# Altium project AerO2.PrjPcb
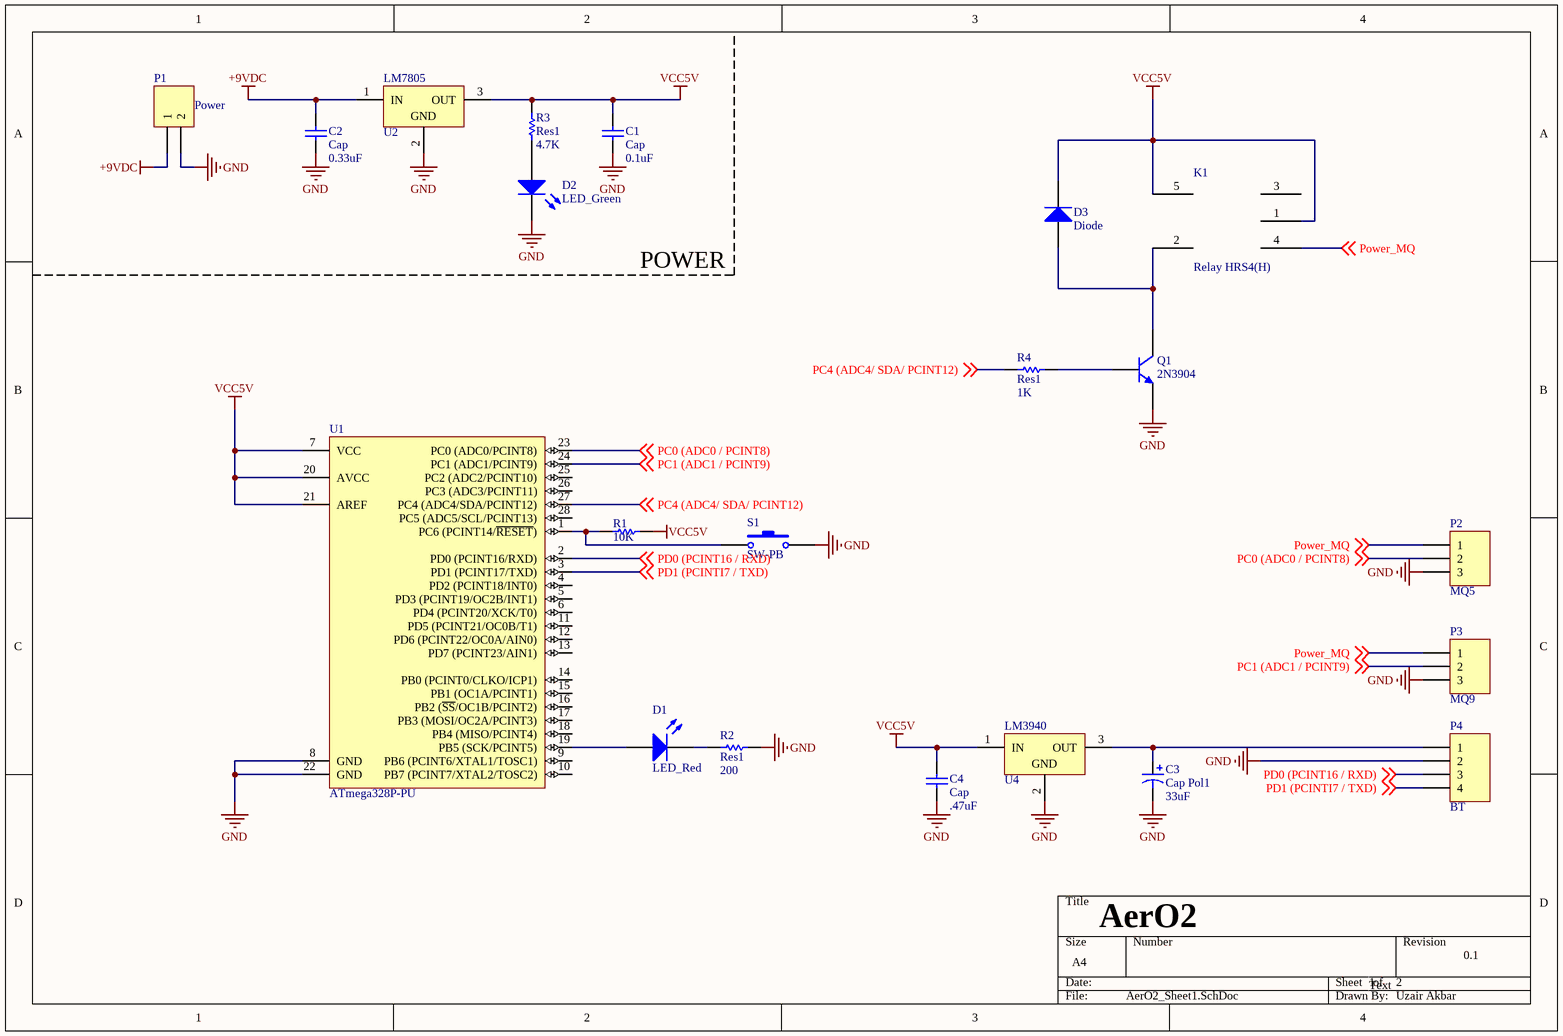
[diagram p0: AerO2_Sheet1.SchDoc]
1 sheet, 21 parts. Net scope: global (net labels, ports and power ports of the same name join across sheets).
Board file: AerO2_PCB1.PcbDoc

## Sheet AerO2_Sheet1.SchDoc: AerO2
size A4; Author: Uzair Akbar; DrawnBy: Uzair Akbar; DocumentNumber: 1; Revision: 0.1; SheetNumber: 1; SheetTotal: 2

### Parts
C1  Cap  value 0.1uF  [RAD-0.1]
C2  Cap  value 0.33uF  [RAD-0.1]
C3  Cap Pol1  value 33uF  [RB5-10.5]
C4  Cap  value .47uF  [RAD-0.1]
D1  LED_Red  [LED-0]
D2  LED_Green  [LED-0]
D3  Diode  [DIODE-0.4]
K1  Relay HRS4(H)  [Relay HRS4(H)]
P1  Power  [HDR1X2]
P2  MQ5  [HDR1X3]
P3  MQ9  [HDR1X3]
P4  BT  [HDR1X4]
Q1  2N3904  [TO-92A]
R1  value 10K  [AXIAL-0.3]  (hidden comment: Res1)
R2  Res1  value 200  [AXIAL-0.3]
R3  Res1  value 4.7K  [AXIAL-0.3]
R4  Res1  value 1K  [AXIAL-0.3]
S1  SW-PB  [SPST-2]
U1  ATmega328P-PU  [28P3]
U2  LM7805  [TO-262-AA]
U4  LM3940  [TO-262-AA]

### Nets
+9VDC: C2.1 P1.1 U2.1(IN)
GND: C1.2 C2.2 C3.2 C4.1 D2.2(K) P1.2 P2.3 P3.3 P4.2 Q1.1(E) R2.2 S1.2 U1.8(GND) U1.22(GND) U2.2(GND) U4.2(GND)
VCC5V: C1.1 C4.2 D3.2(K) K1.1 K1.5 R1.2 R3.2 U1.7(VCC) U1.20(AVCC) U1.21(AREF) U2.3(OUT) U4.1(IN)
PC0 (ADC0 / PCINT8): P2.2 U1.23(PC0_(ADC0/PCINT8)) ; off-sheet PC0 (ADC0 / PCINT8)
PC1 (ADC1 / PCINT9): P3.2 U1.24(PC1_(ADC1/PCINT9)) ; off-sheet PC1 (ADC1 / PCINT9)
PC4 (ADC4/ SDA/ PCINT12): R4.1 U1.27(PC4_(ADC4/SDA/PCINT12)) ; off-sheet PC4 (ADC4/ SDA/ PCINT12)
PD0 (PCINT16 / RXD): P4.3 U1.2(PD0_(PCINT16/RXD)) ; off-sheet PD0 (PCINT16 / RXD)
PD1 (PCINTI7 / TXD): P4.4 U1.3(PD1_(PCINT17/TXD)) ; off-sheet PD1 (PCINTI7 / TXD)
Power_MQ: K1.4 P2.1 P3.1 ; off-sheet Power_MQ
NetC3_1: C3.1 P4.1 U4.3(OUT)
NetD1_1: D1.1(A) U1.19(PB5_(SCK/PCINT5))
NetD1_2: D1.2(K) R2.1
NetD2_1: D2.1(A) R3.1
NetD3_1: D3.1(A) K1.2 Q1.3(C)
NetQ1_2: Q1.2(B) R4.2
NetR1_1: R1.1 S1.1 U1.1(PC6_(PCINT14/~{RESET}))

Not connected (* = marked no-connect by the designer): K1 3; U1 4(PD2_(PCINT18/INT0)) 5(PD3_(PCINT19/OC2B/INT1)) 6(PD4_(PCINT20/XCK/T0)) 9(PB6_(PCINT6/XTAL1/TOSC1)) 10(PB7_(PCINT7/XTAL2/TOSC2)) 11(PD5_(PCINT21/OC0B/T1)) 12(PD6_(PCINT22/OC0A/AIN0)) 13(PD7_(PCINT23/AIN1)) 14(PB0_(PCINT0/CLKO/ICP1)) 15(PB1_(OC1A/PCINT1)) 16(PB2_(~{SS}/OC1B/PCINT2)) 17(PB3_(MOSI/OC2A/PCINT3)) 18(PB4_(MISO/PCINT4)) 25(PC2_(ADC2/PCINT10)) 26(PC3_(ADC3/PCINT11)) 28(PC5_(ADC5/SCL/PCINT13))

### Notes on the sheet
- POWER
- Text

### Library data of the parts
C1 C2 C4 = Cap: Capacitor; Published: 8-Jun-2000; LatestRevisionDate: 17-Jul-2002; LatestRevisionNote: Re-released for DXP Platform.; PackageReference: RAD-0.3; Publisher: Altium Limited; PackageDescription: Radial Cap, Thru-Hole; 2 Leads; 0.3 in Pin Spacing
C3 = Cap Pol1: Polarized Capacitor (Radial); Published: 8-Jun-2000; LatestRevisionDate: 17-Jul-2002; LatestRevisionNote: Re-released for DXP Platform.; PackageReference: RB7.6-15; Publisher: Altium Limited; PackageDescription: Polarized Capacitor (Radial); 2 Leads
D1 D2 = LED0: Typical INFRARED GaAs LED; Published: 8-Jun-2000; LatestRevisionDate: 08-Jul-2005; LatestRevisionNote: Mech Layer 1 removed.; PackageReference: LED-0; Publisher: Altium Limited; PackageDescription: LED; 2 Leads
D3 = Diode: Default Diode; Published: 8-Jun-2000; LatestRevisionDate: 17-Jul-2002; LatestRevisionNote: Re-released for DXP Platform.; PackageVersion: Sep-1996; PackageReference: SMC; Publisher: Altium Limited; PackageDescription: DO-214-AB/SMC; 2 C-Bend Leads; Body 7.9 x 5.9 mm, inc. leads (LxW); Code_JEDEC: DO-214-AB
P1 = Header 2: Header, 2-Pin; LatestRevisionDate: 17-Jul-2002; LatestRevisionNote: Re-released for DXP Platform.; Publisher: Altium Limited
P2 P3 = Header 3: Header, 3-Pin; LatestRevisionDate: 17-Jul-2002; LatestRevisionNote: Re-released for DXP Platform.; Publisher: Altium Limited
P4 = Header 4: Header, 4-Pin; LatestRevisionDate: 17-Jul-2002; LatestRevisionNote: Re-released for DXP Platform.; Publisher: Altium Limited
Q1 = 2N3904: NPN General Purpose Amplifier; Published: 8-Jun-2000; LatestRevisionDate: 15-Jan-2003; LatestRevisionNote: PCB Footprint 'BCY-W3/D4.7' replaced; DatasheetVersion: 1997; PackageVersion: Sep-1998; PackageReference: TO-92A; Publisher: Altium Limited; PackageDescription: TO, Flat Index; 3 In-Line, Axial Leads; Body Dia. 4.5mm; Leads 0.51 x 0.48 mm (max); ComponentLink1Description: Manufacturer Link; ComponentLink1URL: http://www.fairchildsemi.com/; ComponentLink2Description: Datasheet; ComponentLink2URL: http://www.fairchildsemi.com/ds/2N%2F2N3904.pdf
R1-R4 = Res1: Resistor; Published: 8-Jun-2000; LatestRevisionDate: 17-Jul-2002; LatestRevisionNote: Re-released for DXP Platform.; PackageReference: AXIAL-0.3; Publisher: Altium Limited; PackageDescription: Axial Device, Thru-Hole; 2 Leads; 0.3 in Pin Spacing
S1 = SW-PB: Switch; Published: 24-Mar-1999; LatestRevisionDate: 17-Jul-2002; LatestRevisionNote: Re-released for DXP Platform.; PackageReference: SPST-2; Publisher: Altium Limited; PackageDescription: Switch; 2 Leads
U1 = ATmega328P-PU: 8-bit AVR Microcontroller, 32KB Flash, 1KB EEPROM, 2KB SRAM, 28-pin PDIP, Industrial Grade (-40°C to 85°C); Published: 1-Apr-2010; DatasheetVersion: revA, Jan-2010; PackageVersion: revB, Sep-2001; PackageReference: 28P3; Publisher: Altium Limited; PackageDescription: 28-lead (0.300"/7.62mm Wide) Plastic Dual Inline Package (PDIP); Supplier 1: Digi-Key; Supplier Part Number 1: ATMEGA328P-PU-ND; Supplier 2: Farnell; Supplier Part Number 2: 1715487; Supplier 3: Mouser; Supplier Part Number 3: 556-ATMEGA328P-PU; ComponentLink1Description: Manufacturer Link; ComponentLink1URL: http://www.atmel.com/products/avr/default.asp?; ComponentLink2Description: ATmega48A/48PA/88A/88PA/168A/168PA/328/328P Datasheet; ComponentLink2URL: http://www.atmel.com/dyn/resources/prod_documents/8271.pdf; ComponentLink3Description: ATmega48A/48PA/88A/88PA/168A/168PA/328/328P Summary; ComponentLink3URL: http://www.atmel.com/dyn/resources/prod_documents/8271S.pdf; ComponentLink4Description: Atmel.com Home; ComponentLink4URL: http://www.atmel.com
U2 U4 = µA78M05CKC: Positive-Voltage Regulator; Note: Pin 2 is electrically connected to TAB.; Published: 15-Apr-2002; DatasheetVersion: Jul-1999; PackageVersion: Sep-1995; PackageReference: KC03; Publisher: Altium Limited; PackageDescription: TO, Thru-Hole, Vertical, Heatsink Mounted; 3 In-Line Leads; Pitch 2.54 mm; ComponentLink1Description: Manufacturer Link; ComponentLink1URL: http://www.ti.com/; ComponentLink2Description: Datasheet; ComponentLink2URL: http://www-s.ti.com/sc/ds/ua78m05.pdf